# EAGLE design m484sidae_bb (EAGLE 7.3.0)
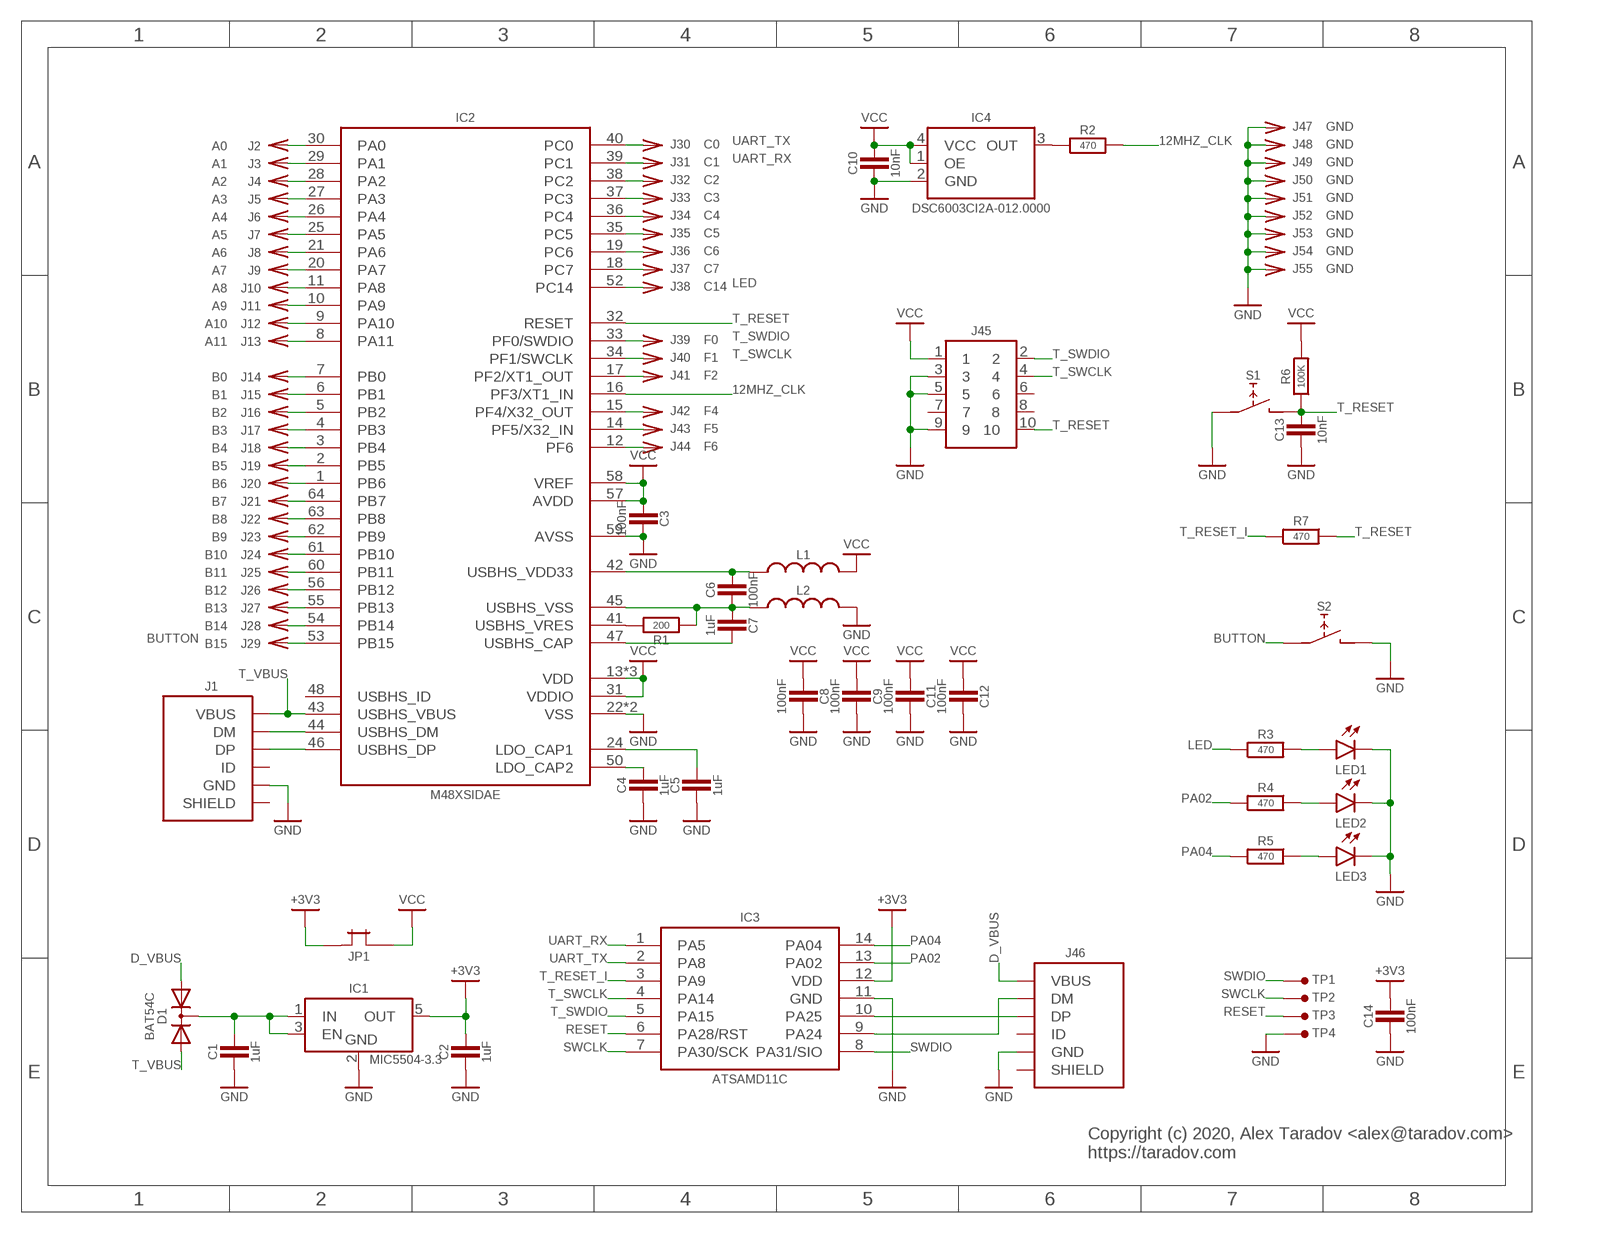
[diagram p0: schematic, sheet 1]

## Parts
C1  1uF  C-0603  [SMD0603]
C2  1uF  C-0603  [SMD0603]
C3  100nF  C-0603  [SMD0603]
C4  1uF  C-0603  [SMD0603]
C5  1uF  C-0603  [SMD0603]
C6  100nF  C-0603  [SMD0603]
C7  1uF  C-0603  [SMD0603]
C8  100nF  C-0603  [SMD0603]
C9  100nF  C-0603  [SMD0603]
C10  10nF  C-0603  [SMD0603]
C11  100nF  C-0603  [SMD0603]
C12  100nF  C-0603  [SMD0603]
C13  10nF  C-0603  [SMD0603]
C14  100nF  C-0603  [SMD0603]
D1  BAT54C  [SOT23]
IC1  MIC5504-3.3  MIC5504-SOT23-5  [SOT23-5]
IC2  M48XSIDAE  [TQFP-64-0.4MM]
IC3  ATSAMD11C  [SO-14]
IC4  DSC6003CI2A-012.0000  OSC_EN-CDFN4  [CDFN4]
J1  USB-B-MICRO-SMT  [USB-B-MICRO-SMT-SHELL-TH]
J2  A0  CONN-SINGLE-TH  [PIN-TH]
J3  A1  CONN-SINGLE-TH  [PIN-TH]
J4  A2  CONN-SINGLE-TH  [PIN-TH]
J5  A3  CONN-SINGLE-TH  [PIN-TH]
J6  A4  CONN-SINGLE-TH  [PIN-TH]
J7  A5  CONN-SINGLE-TH  [PIN-TH]
J8  A6  CONN-SINGLE-TH  [PIN-TH]
J9  A7  CONN-SINGLE-TH  [PIN-TH]
J10  A8  CONN-SINGLE-TH  [PIN-TH]
J11  A9  CONN-SINGLE-TH  [PIN-TH]
J12  A10  CONN-SINGLE-TH  [PIN-TH]
J13  A11  CONN-SINGLE-TH  [PIN-TH]
J14  B0  CONN-SINGLE-TH  [PIN-TH]
J15  B1  CONN-SINGLE-TH  [PIN-TH]
J16  B2  CONN-SINGLE-TH  [PIN-TH]
J17  B3  CONN-SINGLE-TH  [PIN-TH]
J18  B4  CONN-SINGLE-TH  [PIN-TH]
J19  B5  CONN-SINGLE-TH  [PIN-TH]
J20  B6  CONN-SINGLE-TH  [PIN-TH]
J21  B7  CONN-SINGLE-TH  [PIN-TH]
J22  B8  CONN-SINGLE-TH  [PIN-TH]
J23  B9  CONN-SINGLE-TH  [PIN-TH]
J24  B10  CONN-SINGLE-TH  [PIN-TH]
J25  B11  CONN-SINGLE-TH  [PIN-TH]
J26  B12  CONN-SINGLE-TH  [PIN-TH]
J27  B13  CONN-SINGLE-TH  [PIN-TH]
J28  B14  CONN-SINGLE-TH  [PIN-TH]
J29  B15  CONN-SINGLE-TH  [PIN-TH]
J30  C0  CONN-SINGLE-TH  [PIN-TH]
J31  C1  CONN-SINGLE-TH  [PIN-TH]
J32  C2  CONN-SINGLE-TH  [PIN-TH]
J33  C3  CONN-SINGLE-TH  [PIN-TH]
J34  C4  CONN-SINGLE-TH  [PIN-TH]
J35  C5  CONN-SINGLE-TH  [PIN-TH]
J36  C6  CONN-SINGLE-TH  [PIN-TH]
J37  C7  CONN-SINGLE-TH  [PIN-TH]
J38  C14  CONN-SINGLE-TH  [PIN-TH]
J39  F0  CONN-SINGLE-TH  [PIN-TH]
J40  F1  CONN-SINGLE-TH  [PIN-TH]
J41  F2  CONN-SINGLE-TH  [PIN-TH]
J42  F4  CONN-SINGLE-TH  [PIN-TH]
J43  F5  CONN-SINGLE-TH  [PIN-TH]
J44  F6  CONN-SINGLE-TH  [PIN-TH]
J45  HEADER-5X2-TH-1.27  [HEADER-5X2-1.27MM]
J46  USB-B-MICRO-SMT  [USB-B-MICRO-SMT-SHELL-TH]
J47  GND  CONN-SINGLE-TH  [PIN-TH]
J48  GND  CONN-SINGLE-TH  [PIN-TH]
J49  GND  CONN-SINGLE-TH  [PIN-TH]
J50  GND  CONN-SINGLE-TH  [PIN-TH]
J51  GND  CONN-SINGLE-TH  [PIN-TH]
J52  GND  CONN-SINGLE-TH  [PIN-TH]
J53  GND  CONN-SINGLE-TH  [PIN-TH]
J54  GND  CONN-SINGLE-TH  [PIN-TH]
J55  GND  CONN-SINGLE-TH  [PIN-TH]
JP1  JUMPER-TH-TH  [JUMPER-TH]
L1  L-0603  [SMD0603]
L2  L-0603  [SMD0603]
LED1  LED_SMDLED_0603  [SMD0603]
LED2  LED_SMDLED_0603  [SMD0603]
LED3  LED_SMDLED_0603  [SMD0603]
R1  200  R-0603  [SMD0603]
R2  470  R-0603  [SMD0603]
R3  470  R-0603  [SMD0603]
R4  470  R-0603  [SMD0603]
R5  470  R-0603  [SMD0603]
R6  100K  R-0603  [SMD0603]
R7  470  R-0603  [SMD0603]
S1  TACT_SWITCH_6MM-SMD-HALF  [TACT-SMD-6MM-HALF]
S2  TACT_SWITCH_6MM-SMD-HALF  [TACT-SMD-6MM-HALF]
TP1  SIO  TEST-POINT-1.27MM  [TP-1.27MM]
TP2  TEST-POINT-1.27MM  [TP-1.27MM]
TP3  TEST-POINT-1.27MM  [TP-1.27MM]
TP4  TEST-POINT-1.27MM  [TP-1.27MM]

## Nets
12MHZ_CLK: IC2.16(PF3/XT1_IN) R2.2
+3V3: C2.2 C14.2 IC1.5(OUT) IC3.12(VDD) JP1.1
BUTTON: IC2.53(PB15) J29.1 S2.1
D_VBUS: D1.1(A1) J46.1(VBUS)
GND: C1.1 C2.1 C3.2 C4.1 C5.1 C8.2 C9.2 C10.1 C11.2 C12.2 C13.1 C14.1 IC1.2(GND) IC2.22(VSS) IC2.49(VSS) IC2.59(AVSS) IC3.11(GND) IC4.2(GND) J1.5(GND) J45.3 J45.5 J45.9 J46.5(GND) J47.1 J48.1 J49.1 J50.1 J51.1 J52.1 J53.1 J54.1 J55.1 L2.2 LED1.2(C) LED2.2(C) LED3.2(C) S1.1 S2.2 TP4.1
IN: C1.2 D1.3(CC) IC1.1(IN) IC1.3(EN)
LED: IC2.52(PC14) J38.1 R3.1
N$1: IC3.9(PA24) J46.2(DM)
N$2: IC3.10(PA25) J46.3(DP)
N$4: LED2.1(A) R4.2
N$5: IC4.3(OUT) R2.1
N$6: LED3.1(A) R5.2
N$25: IC2.44(USBHS_DM) J1.2(DM)
N$26: IC2.46(USBHS_DP) J1.3(DP)
N$36: IC2.41(USBHS_VRES) R1.2
N$48: C5.2 IC2.24(LDO_CAP1)
N$52: C4.2 IC2.50(LDO_CAP2)
N$54: LED1.1(A) R3.2
N$57: IC2.37(PC3) J33.1
N$58: IC2.38(PC2) J32.1
N$59: IC2.36(PC4) J34.1
N$60: IC2.35(PC5) J35.1
N$61: IC2.19(PC6) J36.1
N$62: IC2.18(PC7) J37.1
N$64: IC2.30(PA0) J2.1
N$65: IC2.29(PA1) J3.1
N$66: IC2.28(PA2) J4.1
N$67: IC2.27(PA3) J5.1
N$68: IC2.26(PA4) J6.1
N$69: IC2.25(PA5) J7.1
N$70: IC2.21(PA6) J8.1
N$71: IC2.20(PA7) J9.1
N$72: IC2.10(PA9) J11.1
N$73: IC2.9(PA10) J12.1
N$74: IC2.8(PA11) J13.1
N$75: IC2.11(PA8) J10.1
N$76: IC2.7(PB0) J14.1
N$77: IC2.6(PB1) J15.1
N$78: IC2.5(PB2) J16.1
N$79: IC2.4(PB3) J17.1
N$80: IC2.3(PB4) J18.1
N$81: IC2.1(PB6) J20.1
N$82: IC2.64(PB7) J21.1
N$83: IC2.63(PB8) J22.1
N$84: IC2.62(PB9) J23.1
N$85: IC2.61(PB10) J24.1
N$86: IC2.60(PB11) J25.1
N$87: IC2.56(PB12) J26.1
N$88: IC2.55(PB13) J27.1
N$89: IC2.54(PB14) J28.1
N$91: IC2.2(PB5) J19.1
N$92: IC2.17(PF2/XT1_OUT) J41.1
N$93: IC2.12(PF6) J44.1
N$94: IC2.15(PF4/X32_OUT) J42.1
N$95: IC2.14(PF5/X32_IN) J43.1
PA02: IC3.13(PA02) R4.1
PA04: IC3.14(PA04) R5.1
RESET: IC3.6(PA28/RST) TP3.1
SWCLK: IC3.7(PA30/SCK) TP2.1
SWDIO: IC3.8(PA31/SIO) TP1.1
T_RESET: C13.2 IC2.32(RESET) J45.10 R6.1 R7.2 S1.2
T_RESET_I: IC3.3(PA9) R7.1
T_SWCLK: IC2.34(PF1/SWCLK) IC3.4(PA14) J40.1 J45.4
T_SWDIO: IC2.33(PF0/SWDIO) IC3.5(PA15) J39.1 J45.2
T_VBUS: D1.2(A2) IC2.43(USBHS_VBUS) J1.1(VBUS)
UART_RX: IC2.39(PC1) IC3.1(PA5) J31.1
UART_TX: IC2.40(PC0) IC3.2(PA8) J30.1
USBHS_CAP: C7.2 IC2.47(USBHS_CAP)
USBHS_GND: C6.1 C7.1 IC2.45(USBHS_VSS) L2.1 R1.1
USBHS_VDD33: C6.2 IC2.42(USBHS_VDD33) L1.1
VCC: C3.1 C8.1 C9.1 C10.2 C11.1 C12.1 IC2.13(VDD) IC2.23(VDD) IC2.31(VDDIO) IC2.51(VDD) IC2.57(AVDD) IC2.58(VREF) IC4.1(OE) IC4.4(VCC) J45.1 JP1.2 L1.2 R6.2
Unconnected: IC2.48(USBHS_ID) J1.4(ID) J1.M1(SHIELD) J1.M2(SHIELD) J1.M3(SHIELD) J1.M4(SHIELD) J45.6 J45.7 J45.8 J46.4(ID) J46.M1(SHIELD) J46.M2(SHIELD) J46.M3(SHIELD) J46.M4(SHIELD)

## Notes on the sheet
- Copyright (c) 2020, Alex Taradov <alex@taradov.com>
  https://taradov.com

## Library data of the parts
C1-C14 = ataradov_rlc:C
D1 = ataradov_semi:BAT54C: BAT54C
IC1 = ataradov_vreg:MIC5504: LM1117 voltage regulator
IC2 = ataradov_mcu:M48XSIDAE
IC3 = ataradov_mcu:ATSAMD11C
IC4 = ataradov_crystal:OSC_EN: Generic oscillator with output enable
J1 J46 = ataradov_conn:USB-B-MICRO
J2-J44 J47-J55 = ataradov_conn:CONN-SINGLE
J45 = ataradov_conn:HEADER-5X2
JP1 = ataradov_conn:JUMPER-TH
L1 L2 = ataradov_rlc:L
LED1-LED3 = ataradov_led:LED_SMD: SMD_LED
R1-R7 = ataradov_rlc:R
S1 S2 = ataradov_switch:TACT_SWITCH_6MM
TP1-TP4 = ataradov_misc:TEST-POINT: Test Point

## Board
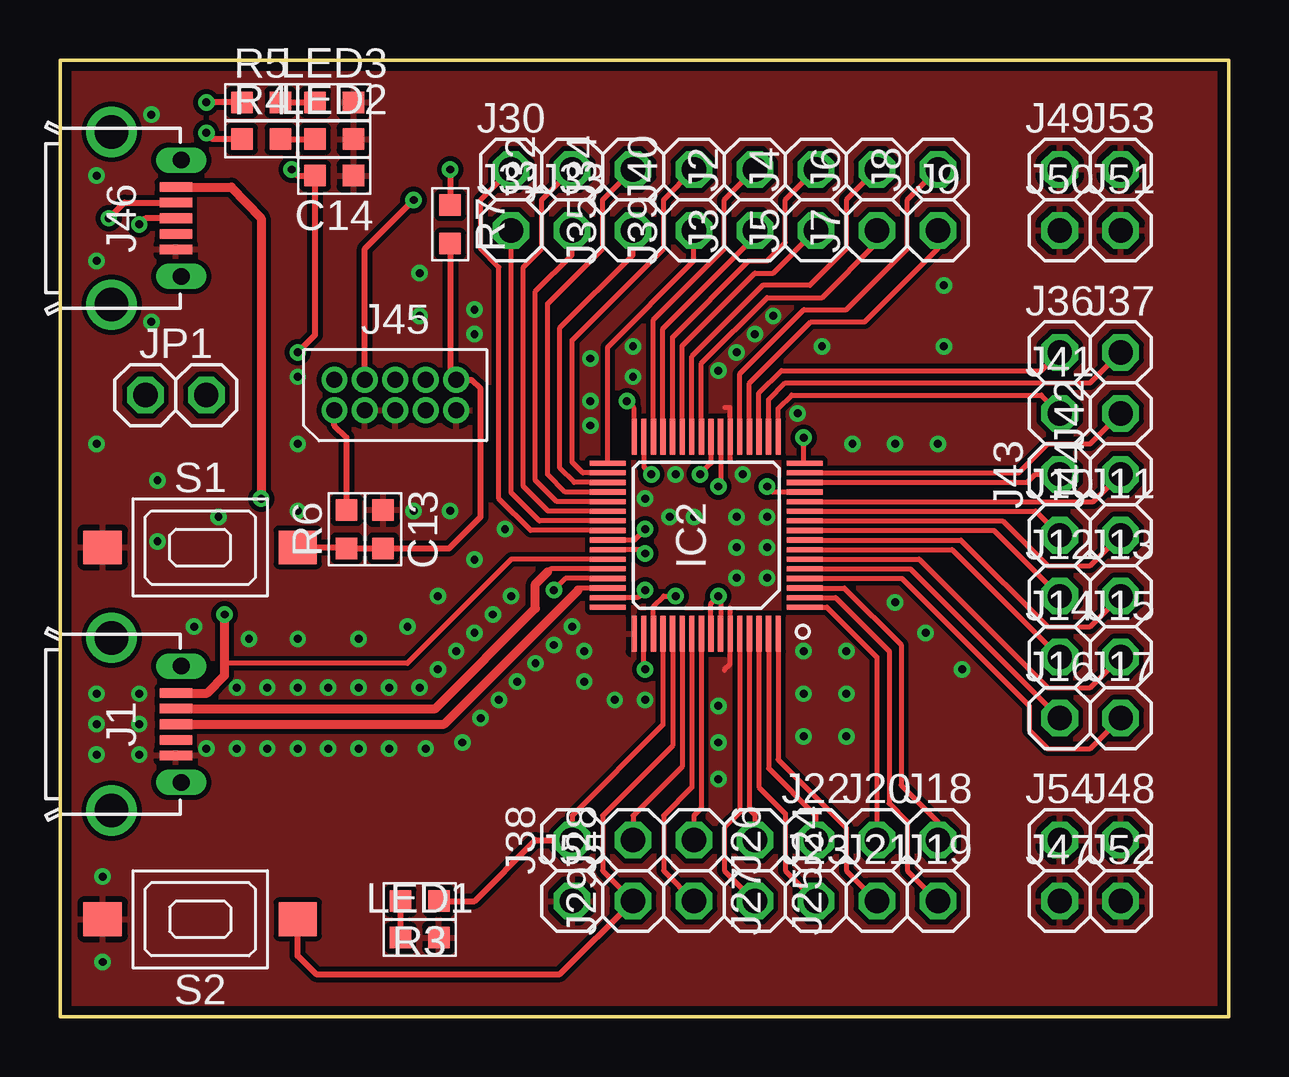
[diagram p1: board, top side]
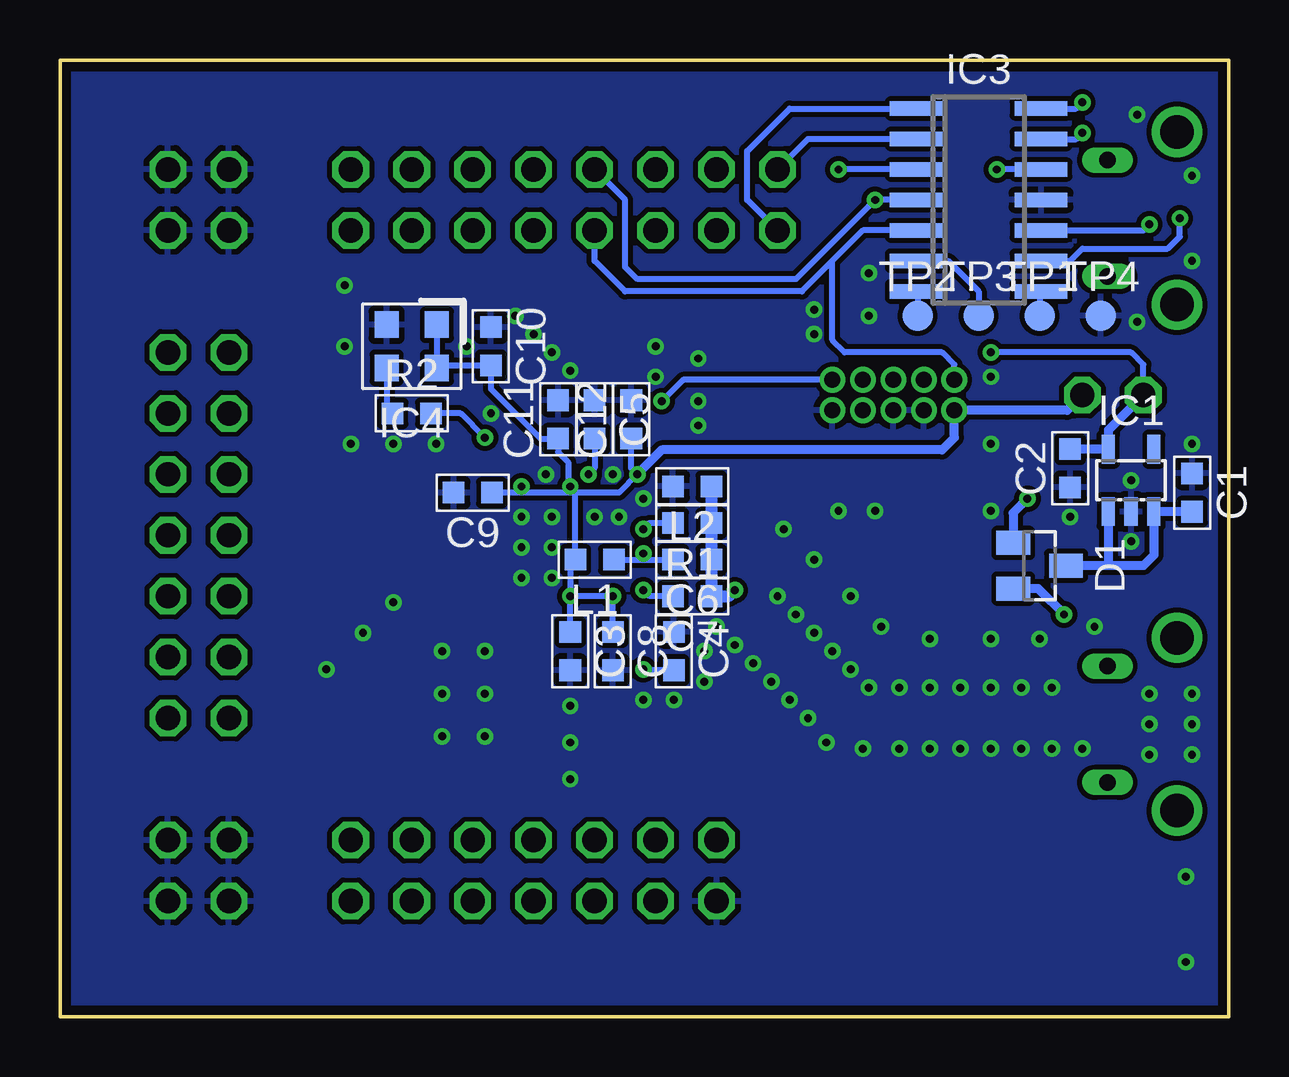
[diagram p2: board, bottom side, seen from below]

Size 48.69 x 39.87 mm. Coordinates in mm from the lower left corner, seen from the top.
Outline: 0,0 48.69,0 48.69,39.87 0,39.87 0,0
Copper layers (1*16): Top 0.0356mm / dielectric 1.5011mm / Bottom 0.0356mm
Design rules "std-tented-new": minimum track width 8mil, minimum drill 12mil, track to track 6mil, track to pad 6mil, pad to pad 6mil, via to via 6mil, smd to smd 6mil, copper to edge 15mil, drill to drill 6mil, minimum pad ring 7mil, minimum via ring 7mil, stop-mask expansion 3mil, vias tented up to drill 25mil, thermal gap 10mil

### Footprints (pad centres in the part's own frame; a part is rotated, then mirrored left to right if it is on the bottom)
SMD0603 = smd 0.9 x 0.9: 1 -0.8,0; 2 0.8,0
SOT23 = smd 1 x 1.4: 1 -0.95,-1.1; 2 0.95,-1.1; 3 0,1.1
SOT23-5 = smd 0.55 x 1.2: 1 -0.95,-1.3; 2 0,-1.3; 3 0.95,-1.3; 4 0.95,1.3; 5 -0.95,1.3
TQFP-64-0.4MM = smd 0.22 x 1.5: 1 -3,-4.1; 2 -2.6,-4.1; 3 -2.2,-4.1; 4 -1.8,-4.1; 5 -1.4,-4.1; 6 -1,-4.1; 7 -0.6,-4.1; 8 -0.2,-4.1; 9 0.2,-4.1; 10 0.6,-4.1; 11 1,-4.1; 12 1.4,-4.1; 13 1.8,-4.1; 14 2.2,-4.1; 15 2.6,-4.1; 16 3,-4.1; 33 3,4.1; 34 2.6,4.1; 35 2.2,4.1; 36 1.8,4.1; 37 1.4,4.1; 38 1,4.1; 39 0.6,4.1; 40 0.2,4.1; 41 -0.2,4.1; 42 -0.6,4.1; 43 -1,4.1; 44 -1.4,4.1; 45 -1.8,4.1; 46 -2.2,4.1; 47 -2.6,4.1; 48 -3,4.1 | smd 1.5 x 0.22: 17 4.1,-3; 18 4.1,-2.6; 19 4.1,-2.2; 20 4.1,-1.8; 21 4.1,-1.4; 22 4.1,-1; 23 4.1,-0.6; 24 4.1,-0.2; 25 4.1,0.2; 26 4.1,0.6; 27 4.1,1; 28 4.1,1.4; 29 4.1,1.8; 30 4.1,2.2; 31 4.1,2.6; 32 4.1,3; 49 -4.1,3; 50 -4.1,2.6; 51 -4.1,2.2; 52 -4.1,1.8; 53 -4.1,1.4; 54 -4.1,1; 55 -4.1,0.6; 56 -4.1,0.2; 57 -4.1,-0.2; 58 -4.1,-0.6; 59 -4.1,-1; 60 -4.1,-1.4; 61 -4.1,-1.8; 62 -4.1,-2.2; 63 -4.1,-2.6; 64 -4.1,-3
SO-14 = smd 0.6 x 2.2: 1 -3.81,-2.6; 2 -2.54,-2.6; 3 -1.27,-2.6; 4 0,-2.6; 5 1.27,-2.6; 6 2.54,-2.6; 7 3.81,-2.6; 8 3.81,2.6; 9 2.54,2.6; 10 1.27,2.6; 11 0,2.6; 12 -1.27,2.6; 13 -2.54,2.6; 14 -3.81,2.6
CDFN4 = smd 1 x 1.1: 1 -1.05,-0.9; 2 1.05,-0.9; 3 1.05,0.9; 4 -1.05,0.9
USB-B-MICRO-SMT-SHELL-TH = smd 1.35 x 0.4: 1 4.825,1.3; 2 4.825,0.65; 3 4.825,0; 4 4.825,-0.65; 5 4.825,-1.3 | drill 1.397: M1 2.15,-3.6; M2 2.15,3.6 | drill 0.7 long: M3 5.05,2.425; M4 5.05,-2.425
PIN-TH = drill 1.016 octagon: 1 0,0
HEADER-5X2-1.27MM = drill 0.66 pad 1.067: 1 -2.54,-0.635; 2 -2.54,0.635; 3 -1.27,-0.635; 4 -1.27,0.635; 5 0,-0.635; 6 0,0.635; 7 1.27,-0.635; 8 1.27,0.635; 9 2.54,-0.635; 10 2.54,0.635
JUMPER-TH = drill 1.016 octagon: 1 -1.27,0; 2 1.27,0
TACT-SMD-6MM-HALF = smd 1.6 x 1.4: 1 -4.064,0; 2 4.064,0
TP-1.27MM = smd 1.27 x 1.27: 1 0,0

### Placement (x,y rotation side)
C1  1.52,21.84 270 bottom
C2  6.6,22.86 90 bottom
C3  27.43,15.24 270 bottom
C4  23.11,15.24 270 bottom
C5  26.42,24.89 270 bottom
C6  22.35,19.05 180 bottom
C7  22.35,17.53 180 bottom
C8  25.65,15.24 270 bottom
C9  31.5,21.84 180 bottom
C10  30.73,27.94 270 bottom
C11  27.94,24.89 90 bottom
C12  24.89,24.89 90 bottom
C13  13.46,20.32 270 top
C14  11.43,35.05 180 top
D1  7.87,18.8 270 bottom
IC1  4.06,22.35 0 bottom
IC2  26.92,20.07 90 top
IC3  10.41,34.04 270 bottom
IC4  34.04,27.94 180 bottom
J1  0,12.19 0 top
J2  28.96,35.31 90 top
J3  28.96,32.77 90 top
J4  31.5,35.31 90 top
J5  31.5,32.77 90 top
J6  34.04,35.31 90 top
J7  34.04,32.77 90 top
J8  36.58,35.31 90 top
J9  36.58,32.77 0 top
J10  41.66,20.07 0 top
J11  44.2,20.07 0 top
J12  41.66,17.53 0 top
J13  44.2,17.53 0 top
J14  41.66,14.99 0 top
J15  44.2,14.99 0 top
J16  41.66,12.45 0 top
J17  44.2,12.45 0 top
J18  36.58,7.37 0 top
J19  36.58,4.83 0 top
J20  34.04,7.37 0 top
J21  34.04,4.83 0 top
J22  31.5,7.37 0 top
J23  31.5,4.83 0 top
J24  28.96,7.37 270 top
J25  28.96,4.83 270 top
J26  26.42,7.37 270 top
J27  26.42,4.83 270 top
J28  23.88,7.37 90 top
J29  23.88,4.83 90 top
J30  18.8,35.31 0 top
J31  18.8,32.77 0 top
J32  21.34,35.31 90 top
J33  21.34,32.77 0 top
J34  23.88,35.31 90 top
J35  23.88,32.77 90 top
J36  41.66,27.69 0 top
J37  44.2,27.69 0 top
J38  21.34,7.37 90 top
J39  26.42,32.77 90 top
J40  26.42,35.31 90 top
J41  41.66,25.15 0 top
J42  44.2,25.15 90 top
J43  41.66,22.61 90 top
J44  44.2,22.61 90 top
J45  13.97,25.91 0 top
J46  0,33.27 0 top
J47  41.66,4.83 0 top
J48  44.2,7.37 0 top
J49  41.66,35.31 0 top
J50  41.66,32.77 0 top
J51  44.2,32.77 0 top
J52  44.2,4.83 0 top
J53  44.2,35.31 0 top
J54  41.66,7.37 0 top
J55  21.34,4.83 0 top
JP1  4.83,25.91 0 top
L1  26.42,19.05 180 bottom
L2  22.35,22.1 180 bottom
LED1  14.99,3.3 0 top
LED2  11.43,36.58 0 top
LED3  11.43,38.1 0 top
R1  22.35,20.57 180 bottom
R2  34.04,25.15 0 bottom
R3  14.99,4.83 180 top
R4  8.38,36.58 0 top
R5  8.38,38.1 0 top
R6  11.94,20.32 90 top
R7  16.26,33.02 270 top
S1  5.84,19.56 0 top
S2  5.84,4.06 180 top
TP1  7.87,29.21 0 bottom
TP2  12.95,29.21 0 bottom
TP3  10.41,29.21 0 bottom
TP4  5.33,29.21 0 bottom

### Tracks (layer width: path | path; a pad name or v marks a point on that pad's centre or on a via)
12MHZ_CLK  (via drill 0.33)
  Top 0.203: IC2.16 30.99,23.1 v30.99,24.13
  Bottom 0.254: v30.99,24.13 32,25.15 R2.2
+3V3  (via drill 0.33, 0.33 pad 0.51)
  Top 0.254: v9.65,35.31 9.91,35.05 C14.2 10.63,28.41 v9.91,27.69
  Bottom 0.254: IC3.12 v9.65,35.31 | 5.02,23.66 IC1.5 | JP1.1 3.56,27.18 4.06,27.69 v9.91,27.69
  Bottom 0.381: C2.2 5.02,23.66 | JP1.1 5.01,24.45 IC1.5
BUTTON
  Top 0.203: IC2.53 25.52,11.3 22.61,8.38 22.61,6.1 J29.1
  Top 0.254: J29.1 20.83,1.78 10.67,1.78 9.91,2.54 S2.1
D_VBUS  (via drill 0.33)
  Top 0.381: J46.1 7.14,34.57 8.38,33.27 v8.38,21.59
  Bottom 0.381: v8.38,21.59 8.97,21 D1.1
GND  (via drill 0.33 pad 0.25)
  Top 0.203: 27.92,23.15 IC2.22 27.92,25.38 27.7,25.38 | 27.92,17.03 IC2.59 27.92,14.7 27.69,14.46 27.69,14.44
  other vias: 1.52,35.05 1.52,31.5 3.81,37.59 3.81,28.96 8.64,13.72 25.65,22.61 11.18,13.72 9.91,13.72 28.96,28.45 27.43,26.92 23.88,26.67 23.88,27.94 27.43,12.95 27.43,11.43 29.72,29.21 28.19,27.69 33.02,23.88 34.8,23.88 36.58,23.88 32.77,15.24 32.77,13.46 32.77,11.68 7.37,13.72 12.45,13.72 13.72,13.72 14.99,13.72 15.75,14.48 16.51,15.24 17.27,16 18.03,16.76 18.8,17.53 18.54,20.32 7.37,11.18 8.64,11.18 9.91,11.18 11.18,11.18 12.45,11.18 13.72,11.18 15.24,11.18 17.53,12.45 16.76,11.43 18.29,13.21 19.05,13.97 19.81,14.73 20.57,15.49 21.34,16.26 6.1,11.18 1.52,13.46 1.52,12.19 1.52,10.92 3.3,10.92 3.3,13.46 3.3,12.19 36.07,16 34.8,17.27 37.59,14.48 22.1,27.43 22.1,25.65 22.1,24.64 23.11,13.21 24.38,13.21 21.84,15.24 17.27,19.05 15.75,17.53 7.87,15.75 5.59,16.26 9.91,15.75 12.45,15.75 14.48,16.26 27.43,9.91 21.84,13.97 29.46,20.83 24.38,21.59 28.19,20.83 29.46,19.56 28.19,18.29 26.42,20.83 25.4,20.83 28.45,22.61 30.99,11.68 30.99,13.46 30.99,15.24 30.73,25.15 36.83,27.94 28.19,19.56 29.46,18.29 36.83,30.48 31.75,27.94 14.99,29.21 17.27,29.46 17.27,28.45 1.78,5.84 1.78,2.29 14.99,30.99 14.73,21.08 16.26,21.08 4.06,19.81 4.06,22.35 6.6,20.83 1.52,23.88 9.91,26.67 9.91,23.88 9.91,21.08
  pour Bottom (isolate 0.203): 0,40.13 48.77,39.88 48.77,0 0,0
  pour Top (isolate 0.203): 0,40.13 48.77,39.88 48.77,0 0,0
IN
  Bottom 0.254: C1.2 1.53,21.05 | 5.01,18.86 5.08,18.8
  Bottom 0.381: 1.53,21.05 IC1.3 3.11,19.24 3.56,18.8 5.08,18.8 D1.3 | IC1.1 5.01,18.86
LED
  Top 0.203: IC2.52 25.12,12.17 21.34,8.38 J38.1
  Top 0.254: R3.1 17.27,4.83 19.81,7.37 J38.1
N$1  (via drill 0.33 pad 0.25)
  Top 0.254: v2.03,33.27 2.68,33.92 J46.2
  Bottom 0.254: IC3.9 6.6,31.5 6.1,32 2.54,32 2.03,32.51 v2.03,33.27
N$2  (via drill 0.33 pad 0.25)
  Top 0.254: J46.3 3.56,33.27 v3.3,33.02
  Bottom 0.254: IC3.10 3.56,32.77 v3.3,33.02
N$4
  Top 0.254: R4.2 LED2.1
N$5
  Bottom 0.203: 35.09,25.4 R2.1
  Bottom 0.254: IC4.3 35.09,25.4
N$6
  Top 0.254: R5.2 LED3.1
N$25
  Top 0.203: IC2.44 20.44,18.67 20.32,18.54
  Top 0.381: J1.2 15.64,12.84 19.81,17.02 19.81,18.03 20.32,18.54
N$26
  Top 0.203: IC2.46 21.68,17.87 21.59,17.78
  Top 0.381: J1.3 16,12.19 21.59,17.78
N$36  (via drill 0.33)
  Top 0.203: v24.38,20.32 23.93,19.87 IC2.41
  Bottom 0.254: R1.2 24.13,20.57 v24.38,20.32
N$48  (via drill 0.33)
  Top 0.203: IC2.24 27.12,23.06 v26.67,22.61
  Bottom 0.254: C5.2 26.42,22.86 v26.67,22.61
N$52  (via drill 0.33)
  Top 0.203: IC2.50 24.32,14.54 v24.38,14.48
  Bottom 0.254: C4.2 24.35,14.44 v24.38,14.48
N$54
  Top 0.254: R3.2 LED1.1
N$57
  Top 0.203: IC2.37 20.7,21.47 19.81,22.35 19.81,30.23 21.34,31.75 J33.1
N$58
  Top 0.203: IC2.38 20.34,21.07 19.3,22.1 19.3,31.24 20.07,32 20.07,34.04 J32.1
N$59
  Top 0.203: IC2.36 21.06,21.87 20.32,22.61 20.32,29.72 22.61,32 22.61,34.04 J34.1
N$60
  Top 0.203: IC2.35 21.42,22.27 20.83,22.86 20.83,28.7 23.88,31.75 J35.1
N$61
  Top 0.203: IC2.19 29.12,25.99 30.05,26.92 40.89,26.92 J36.1
N$62
  Top 0.203: IC2.18 29.52,25.71 30.23,26.42 42.93,26.42 J37.1
N$64
  Top 0.203: IC2.30 24.72,29.04 27.69,32 27.69,34.04 J2.1
N$65
  Top 0.203: IC2.29 25.12,28.68 28.96,32.51 J3.1
N$66
  Top 0.203: IC2.28 25.52,28.32 28.7,31.5 29.46,31.5 30.23,32.26 30.23,34.04 J4.1
N$67
  Top 0.203: IC2.27 25.92,27.96 28.96,30.99 29.72,30.99 J5.1
N$68
  Top 0.203: IC2.26 26.32,27.52 29.28,30.48 31.24,30.48 32.77,32 32.77,34.04 J6.1
N$69
  Top 0.203: IC2.25 26.72,27.23 29.46,29.97 31.75,29.97 34.04,32.26 J7.1
N$70
  Top 0.203: IC2.21 28.32,26.79 30.99,29.46 32.77,29.46 35.31,32 35.31,34.04 J8.1
N$71
  Top 0.203: IC2.20 28.72,26.39 31.29,28.96 33.53,28.96 36.58,32 J9.1
N$72
  Top 0.203: IC2.10 39.28,20.67 41.15,18.8 42.93,18.8 J11.1
N$73
  Top 0.203: IC2.9 38.92,20.27 J12.1
N$74
  Top 0.203: IC2.8 37.54,19.87 41.15,16.26 42.93,16.26 J13.1
N$75
  Top 0.203: IC2.11 40.66,21.07 J10.1
N$76
  Top 0.203: IC2.7 37.18,19.47 J14.1
N$77
  Top 0.203: IC2.6 35.8,19.07 41.15,13.72 42.93,13.72 J15.1
N$78
  Top 0.203: IC2.5 35.44,18.67 J16.1
N$79
  Top 0.203: IC2.4 35.07,18.27 40.39,12.95 40.39,11.94 41.15,11.18 42.93,11.18 J17.1
N$80
  Top 0.203: IC2.3 32.68,17.87 35.05,15.49 35.05,9.65 36.58,8.13 J18.1
N$81
  Top 0.203: IC2.1 31.96,17.07 34.04,14.99 J20.1
N$82
  Top 0.203: IC2.64 29.92,10.72 32.77,7.87 32.77,6.1 J21.1
N$83
  Top 0.203: IC2.63 29.52,10.35 31.5,8.38 J22.1
N$84
  Top 0.203: IC2.62 29.12,9.57 30.23,8.46 30.23,6.1 J23.1
N$85
  Top 0.203: IC2.61 28.72,8.66 28.96,8.43 J24.1
N$86
  Top 0.203: IC2.60 28.32,8.51 27.69,7.87 27.69,6.1 J25.1
N$87
  Top 0.203: IC2.56 26.72,8.69 26.42,8.38 J26.1
N$88
  Top 0.203: IC2.55 26.32,9.56 25.15,8.38 25.15,6.1 J27.1
N$89
  Top 0.203: IC2.54 25.92,10.43 23.88,8.38 J28.1
N$91
  Top 0.203: IC2.2 32.32,17.47 34.54,15.24 34.54,8.89 35.31,8.13 35.31,6.1 J19.1
N$92
  Top 0.203: IC2.17 29.92,25.35 30.48,25.91 40.89,25.91 J41.1
N$93
  Top 0.203: IC2.12 43.06,21.47 J44.1
N$94
  Top 0.203: IC2.15 39.94,22.67 41.15,23.88 42.93,23.88 J42.1
N$95
  Top 0.203: IC2.14 40.3,22.27 40.64,22.61 J43.1
PA02  (via drill 0.33)
  Top 0.254: R4.1 6.35,36.58 v6.1,36.83
  Bottom 0.254: IC3.13 6.35,36.58 v6.1,36.83
PA04  (via drill 0.33)
  Top 0.254: R5.1 v6.1,38.1
  Bottom 0.254: IC3.14 6.35,37.85 v6.1,38.1
RESET
  Bottom 0.254: IC3.6 11.68,31.5 10.41,30.23 TP3.1
SWCLK
  Bottom 0.254: IC3.7 12.95,30.17 TP2.1
SWDIO
  Bottom 0.254: IC3.8 7.87,30.17 TP1.1
T_RESET  (via drill 0.33)
  Top 0.203: IC2.32 23.92,25.35 v23.62,25.65
  Top 0.254: R7.2 16.26,26.8 J45.10 17.14,26.54 17.53,26.16 17.53,20.83 16.22,19.52 C13.2 R6.1 11.9,19.56 S1.2
  Bottom 0.254: J45.10 22.73,26.54 v23.62,25.65
T_RESET_I  (via drill 0.33)
  Top 0.254: v16.26,35.31 R7.1
  Bottom 0.254: IC3.3 v16.26,35.31
T_SWCLK  (via drill 0.33)
  Top 0.203: IC2.34 21.78,22.67 21.34,23.11 21.34,28.19 25.15,32 25.15,34.04 J40.1
  Top 0.254: J45.4 12.7,32 v14.73,34.04
  Bottom 0.254: IC3.4 v14.73,34.04 18.03,30.73 24.64,30.73 25.15,31.24 25.15,34.04 J40.1
T_SWDIO
  Top 0.203: IC2.33 22.82,27.9 26.42,31.5 J39.1
  Bottom 0.254: IC3.5 15.24,32.77 16.51,31.5 | J39.1 26.42,31.5 25.15,30.23 17.78,30.23 16.51,31.5 | J45.2 11.43,27.18 11.94,27.69 16,27.69 16.51,28.19 16.51,31.5
T_VBUS  (via drill 0.33)
  Top 0.203: IC2.43 18.81,19.07 14.48,14.73 6.86,14.73
  Top 0.381: J1.1 6.13,13.49 6.86,14.22 6.86,14.73 v6.86,16.76
  Bottom 0.381: v6.86,16.76 7.94,17.85 D1.2
UART_RX
  Top 0.203: IC2.39 19.97,20.67 18.8,21.84 J31.1
  Bottom 0.254: J31.1 20.07,34.04 20.07,36.07 18.29,37.85 IC3.1
UART_TX
  Top 0.203: IC2.40 19.61,20.27 18.29,21.59 18.29,31.24 17.53,32 17.53,34.04 J30.1
  Bottom 0.254: IC3.2 17.53,36.58 J30.1
USBHS_CAP  (via drill 0.33)
  Top 0.203: v24.38,17.78 24.07,17.47 IC2.47
  Bottom 0.254: C7.2 24.13,17.53 v24.38,17.78
USBHS_GND  (via drill 0.33)
  Top 0.203: IC2.45 21.06,18.27 v20.57,17.78
  Bottom 0.508: L2.1 R1.1 C6.1 C7.1 20.83,17.53 v20.57,17.78
USBHS_VDD33  (via drill 0.33)
  Top 0.203: v24.38,19.3 24.22,19.47 IC2.42
  Bottom 0.254: L1.1 24.38,19.05 | 24.38,19.05 C6.2 | v24.38,19.3 24.38,19.05
VCC  (via drill 0.33)
  Top 0.203: IC2.31 24.32,22.92 v24.64,22.61 | IC2.23 27.52,22.26 v27.43,22.1 | IC2.51 24.72,17.1 25.15,17.53 v25.65,17.53 | IC2.57 27.12,17.22 v27.43,17.53 27.52,17.43 IC2.58 | IC2.13 29.7,21.87 v29.46,22.1
  Top 0.254: R6.2 11.94,24.13 11.43,24.64 J45.1
  Bottom 0.203: IC4.4 32.89,27.14 | L1.2 27.43,18.83
  Bottom 0.254: C12.1 24.89,22.86 v24.64,22.61 25.4,21.84 27.18,21.84 | IC4.1 IC4.4 | 32.89,27.14 C10.2 30.73,26.16 28.66,24.09 C11.1 27.94,23.53 27.52,23.11 27.52,22.19 v27.43,22.1 27.22,21.88 | C8.1 v25.65,17.53 v27.43,17.53 | C3.1 v27.43,17.53 | 27.43,18.83 v27.43,17.53 | L1.2 27.22,21.88 | 27.18,21.84 29.46,21.84 | 29.46,21.84 C9.1 | v29.46,22.1 29.46,21.84 | 27.22,21.88 27.18,21.84
  Bottom 0.381: v24.64,22.61 23.62,23.62 11.94,23.62 11.43,24.13 J45.1 6.73,25.27 JP1.2

### Text on the board
tValues: VIN | VCC | RESET | Nuvoton M484SIDAE | www.taradov.com
bValues: AT | 11/27/20